# Altium schematic sheet USB-C.SchDoc
size A; SheetNumber: 3; SheetTotal: 8
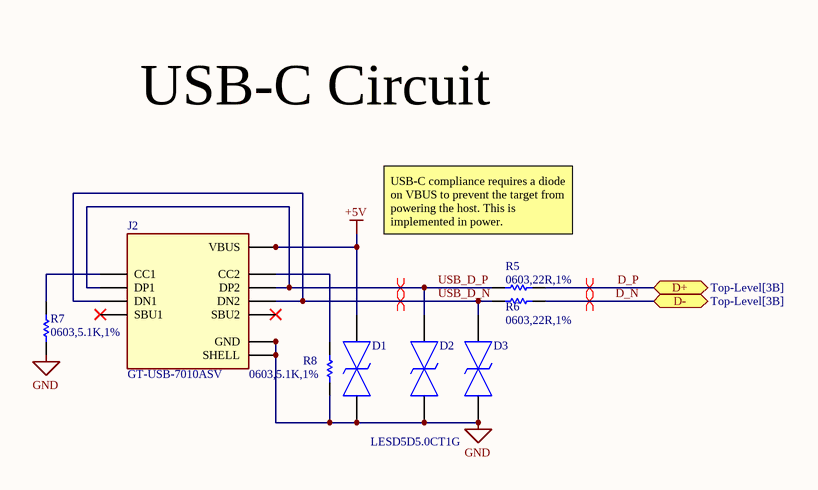
[diagram p0: USB-C.SchDoc]

## Parts
D1  LESD5D5.0CT1G  [LESD5D50CT1G]  (value not drawn)
D2  LESD5D5.0CT1G  [LESD5D50CT1G]  (value not drawn)
D3  LESD5D5.0CT1G  [LESD5D50CT1G]
J2  GT-USB-7010ASV  [USB-C-SMD_G-SWITCH_GT-USB-7010ASV]
R5  0603,22R,1%  [RESC1608X55N]
R6  0603,22R,1%  [RESC1608X55N]
R7  0603,5.1K,1%  [RESC1608X55N]
R8  0603,5.1K,1%  [RESC1608X55N]

## Ports
D+ (bidir, see Top-Level[3B]), D- (bidir, see Top-Level[3B])

## Nets
+5V: D1.2 J2.A4B9(VBUS) J2.B4A9(VBUS)
GND: D1.1 D2.1 D3.1 J2.1(SHELL) J2.2(SHELL) J2.3(SHELL) J2.4(SHELL) J2.A1B12(GND) J2.B1A12(GND) R7.1 R8.1
D_N: R6.2 ; port D-
D_P: R5.2 ; port D+
USB_D_N: D3.2 J2.A7(DN1) J2.B7(DN2) R6.1
USB_D_P: D2.2 J2.A6(DP1) J2.B6(DP2) R5.1
NetJ2_A5: J2.A5(CC1) R7.2
NetJ2_B5: J2.B5(CC2) R8.2

Not connected (* = marked no-connect by the designer): J2 A8(SBU1)* B8(SBU2)*

## Layout directives
differential pair: D_N, D_P, USB_D_N, USB_D_P

## Notes on the sheet
- USB-C Circuit
- USB-C compliance requires a diode on VBUS to prevent the target from powering the host. This is implemented in power.

## Library data of the parts
D1-D3 = LESD5D5.0CT1G: 9.4A 18.6V 5.6V Bidirectional 5V SOD-523 ESD and Surge Protection (TVS/ESD) ROHS; Manufacturer_Name: LRC; Height: 0.7mm; Manufacturer_Part_Number: LESD5D5.0CT1G; LCSC Part Number: C383211
J2 = GT-USB-7010ASV: USB 2.0 3A 1 Surface Mount, Right Angle 16P Female -40℃~+85℃ Type-C SMD USB Connectors ROHS; LCSC Part Number: C2988369
R5 R6 = RC0603FR-0722RL: 100mW Thick Film Resistor 75V ±100ppm/℃ ±1% 22Ω 0603 Chip Resistor - Surface Mount ROHS; Manufacturer_Name: YAGEO; Datasheet Link: http://www.farnell.com/datasheets/1868787.pdf; Height: 0.55mm; Manufacturer_Part_Number: RC0603FR-0722RL; Mouser Part Number: 603-RC0603FR-0722RL; Mouser Price/Stock: https://www.mouser.co.uk/ProductDetail/YAGEO/RC0603FR-0722RL?qs=diQw95jMAeMOsxb8bne7fg%3D%3D; Arrow Part Number: RC0603FR-0722RL; Arrow Price/Stock: https://www.arrow.com/en/products/rc0603fr-0722rl/yageo?region=nac; LCSC Part Number: C107701
R7 R8 = RC0603FR-075K1L: 100mW Thick Film Resistor 75V ±100ppm/℃ ±1% 5.1kΩ 0603 Chip Resistor - Surface Mount ROHS; Manufacturer_Name: YAGEO; Manufacturer_Part_Number: RC0603FR-0710KL; Datasheet Link: https://www.mouser.in/datasheet/2/447/PYu_RC_Group_51_RoHS_L_11-1984063.pdf; Height: 0.55mm; Mouser Part Number: 603-RC0603FR-0710KL; Mouser Price/Stock: https://www.mouser.co.uk/ProductDetail/YAGEO/RC0603FR-0710KL?qs=grNVn54RoB%252B3GtjbJj3wJQ%3D%3D; Arrow Part Number: RC0603FR-0710KL; Arrow Price/Stock: https://www.arrow.com/en/products/rc0603fr-0710kl/yageo?utm_currency=USD&region=nac; LCSC Part Number: C105580